# EAGLE schematic PART1 (EAGLE 9.6.2)
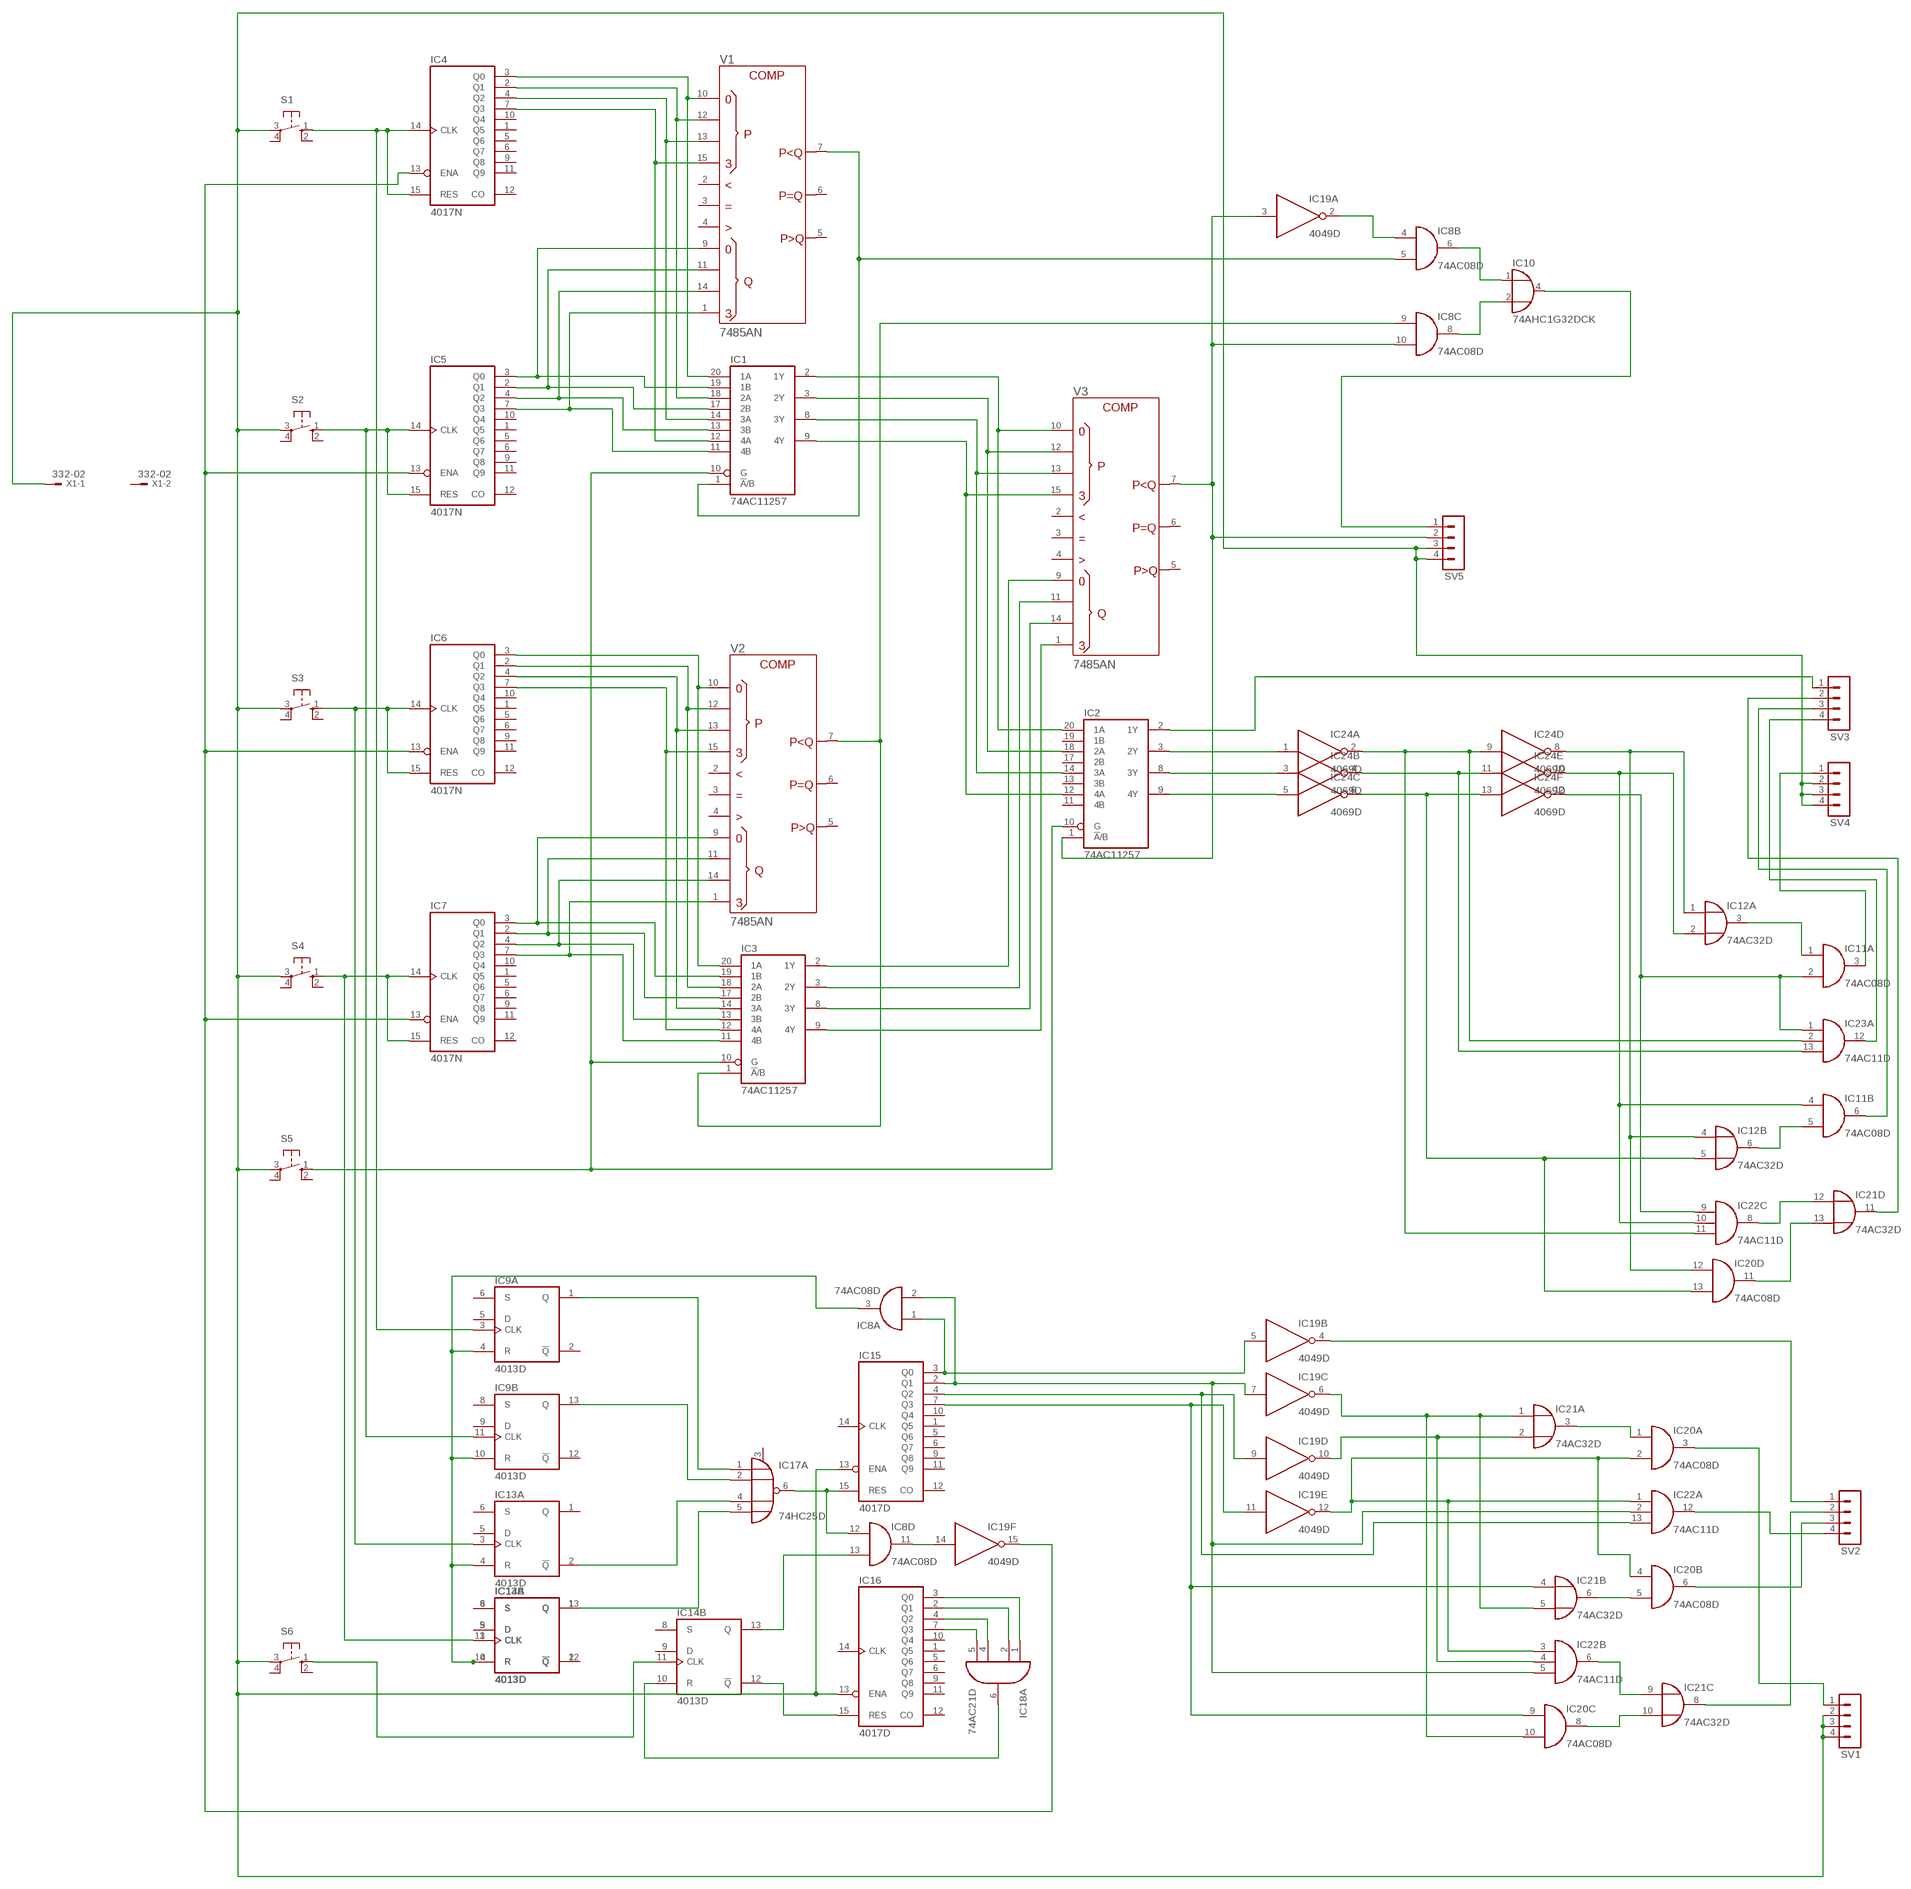
[diagram p0: schematic, sheet 1]

## Parts
IC1  74AC11257  [DIL20]
IC2  74AC11257  [DIL20]
IC3  74AC11257  [DIL20]
IC4  4017N  [DIL16]
IC5  4017N  [DIL16]
IC6  4017N  [DIL16]
IC7  4017N  [DIL16]
IC8  74AC08D  [SO14]
IC9  4013D  [SO14]
IC10  74AHC1G32DCK  [SC70-5]
IC11  74AC08D  [SO14]
IC12  74AC32D  [SO14]
IC13  4013D  [SO14]
IC14  4013D  [SO14]
IC15  4017D  [SO16]
IC16  4017D  [SO16]
IC17  74HC25D  [SO14]
IC18  74AC21D  [SO14]
IC19  4049D  [SO16]
IC20  74AC08D  [SO14]
IC21  74AC32D  [SO14]
IC22  74AC11D  [SO14]
IC23  74AC11D  [SO14]
IC24  4069D  [SO14]
S1  10-XX  [B3F-10XX]
S2  10-XX  [B3F-10XX]
S3  10-XX  [B3F-10XX]
S4  10-XX  [B3F-10XX]
S5  10-XX  [B3F-10XX]
S6  10-XX  [B3F-10XX]
SV1  MA04-1  [MA04-1]
SV2  MA04-1  [MA04-1]
SV3  MA04-1  [MA04-1]
SV4  MA04-1  [MA04-1]
SV5  MA04-1  [MA04-1]
V1  7485AN  [DIL16]
V2  7485AN  [DIL16]
V3  7485AN  [DIL16]
X1  332-02  [332-02]

## Nets
N$1: IC13.2(A:!Q) IC17.4(A:I2)
N$2: IC1.20(1A) IC4.3(Q0) V1.10(P0)
N$3: IC5.14(CLK) IC5.15(RES) IC9.11(B:CLK) S2.1(S)
N$4: IC6.14(CLK) IC6.15(RES) IC13.3(A:CLK) S3.1(S)
N$5: IC1.18(2A) IC4.2(Q1) V1.12(P1)
N$6: IC1.14(3A) IC4.4(Q2) V1.13(P2)
N$7: IC4.13(ENA) IC5.13(ENA) IC6.13(ENA) IC7.13(ENA) IC19.15(F:O)
N$8: IC1.12(4A) IC4.7(Q3) V1.15(P3)
N$9: IC1.19(1B) IC5.3(Q0) V1.9(Q0)
N$10: IC1.17(2B) IC5.2(Q1) V1.11(Q1)
N$11: IC1.13(3B) IC5.4(Q2) V1.14(Q2)
N$12: IC1.11(4B) IC5.7(Q3) V1.1(Q3)
N$13: IC3.11(4B) IC7.7(Q3) V2.1(Q3)
N$14: IC1.10(G) IC2.10(G) IC3.10(G) S5.1(S)
N$15: IC1.2(1Y) IC2.20(1A) V3.10(P0)
N$16: IC1.3(2Y) IC2.18(2A) V3.12(P1)
N$17: IC3.20(1A) IC6.3(Q0) V2.10(P0)
N$18: IC3.18(2A) IC6.2(Q1) V2.12(P1)
N$19: IC3.14(3A) IC6.4(Q2) V2.13(P2)
N$20: IC3.12(4A) IC6.7(Q3) V2.15(P3)
N$21: IC3.19(1B) IC7.3(Q0) V2.9(Q0)
N$22: IC3.17(2B) IC7.2(Q1) V2.11(Q1)
N$23: IC3.13(3B) IC7.4(Q2) V2.14(Q2)
N$24: IC1.8(3Y) IC2.14(3A) V3.13(P2)
N$25: IC2.1(!A!/B) IC8.10(C:I1) IC19.3(A:I) SV5.2 V3.7(PLTQ)
N$26: IC3.9(4Y) V3.1(Q3)
N$27: IC3.8(3Y) V3.14(Q2)
N$28: IC3.3(2Y) V3.11(Q1)
N$29: IC1.1(!A!/B) IC8.5(B:I1) V1.7(PLTQ)
N$30: IC3.1(!A!/B) IC8.9(C:I0) V2.7(PLTQ)
N$31: IC3.2(1Y) V3.9(Q0)
N$32: IC8.4(B:I0) IC19.2(A:O)
N$33: IC8.8(C:O) IC10.2(I1)
N$34: IC8.6(B:O) IC10.1(I0)
N$35: IC10.4(O) SV5.1
N$36: IC1.9(4Y) IC2.12(4A) V3.15(P3)
N$38: IC22.11(C:I2) IC23.2(A:I1) IC24.2(A:O) IC24.9(D:I)
N$39: IC23.13(A:I2) IC24.4(B:O) IC24.11(E:I)
N$40: IC12.5(B:I1) IC20.13(D:I1) IC24.6(C:O) IC24.13(F:I)
N$41: IC12.1(A:I0) IC12.4(B:I0) IC20.12(D:I0) IC24.8(D:O)
N$42: IC2.9(4Y) IC24.5(C:I)
N$43: IC2.8(3Y) IC24.3(B:I)
N$44: IC2.3(2Y) IC24.1(A:I)
N$45: IC2.2(1Y) SV3.1
N$47: IC11.2(A:I1) IC22.9(C:I0) IC23.1(A:I0) IC24.12(F:O)
N$48: IC11.1(A:I0) IC12.3(A:O)
N$49: IC11.3(A:O) SV4.1
N$51: IC13.13(B:Q) IC14.1(A:Q)
N$52: IC13.12(B:!Q) IC14.2(A:!Q)
N$53: IC7.14(CLK) IC7.15(RES) IC13.11(B:CLK) IC14.3(A:CLK) S4.1(S)
N$54: IC8.3(A:O) IC9.4(A:R) IC9.10(B:R) IC13.4(A:R) IC13.10(B:R) IC14.4(A:R)
N$55: IC13.9(B:D) IC14.5(A:D)
N$56: IC13.8(B:S) IC14.6(A:S)
N$57: IC8.1(A:I0) IC15.3(Q0) IC19.5(B:I)
N$58: IC8.2(A:I1) IC15.2(Q1) IC19.7(C:I) IC22.2(A:I1) IC22.5(B:I2)
N$59: IC15.13(ENA) IC16.13(ENA) S1.3(P) S2.3(P) S3.3(P) S4.3(P) S5.3(P) S6.3(P) SV1.2 SV1.3 SV1.4 SV4.2 SV4.3 SV4.4 SV5.3 SV5.4 X1.1
N$60: IC9.1(A:Q) IC17.1(A:I0)
N$61: IC9.13(B:Q) IC17.2(A:I1)
N$62: IC17.5(A:I3)
N$63: IC8.12(D:I0) IC15.15(RES) IC17.6(A:O)
N$64: IC16.3(Q0) IC18.1(A:I0)
N$65: IC16.2(Q1) IC18.2(A:I1)
N$66: IC16.4(Q2) IC18.4(A:I2)
N$67: IC16.7(Q3) IC18.5(A:I3)
N$68: IC14.10(B:R) IC18.6(A:O)
N$69: IC8.13(D:I1) IC14.13(B:Q)
N$70: IC14.11(B:CLK) S6.1(S)
N$71: IC14.12(B:!Q) IC16.15(RES)
N$72: IC15.4(Q2) IC19.9(D:I) IC22.13(A:I2)
N$73: IC15.7(Q3) IC19.11(E:I) IC20.9(C:I0) IC21.4(B:I0)
N$74: IC8.11(D:O) IC19.14(F:I)
N$75: IC19.6(C:O) IC20.10(C:I1) IC21.1(A:I0) IC21.5(B:I1)
N$76: IC4.14(CLK) IC4.15(RES) IC9.3(A:CLK) S1.1(S)
N$77: IC19.10(D:O) IC21.2(A:I1) IC22.4(B:I1)
N$78: IC20.1(A:I0) IC21.3(A:O)
N$79: IC19.12(E:O) IC20.2(A:I1) IC20.4(B:I0) IC22.1(A:I0) IC22.3(B:I0)
N$80: IC19.4(B:O) SV2.1
N$81: IC21.8(C:O) SV2.2
N$82: IC20.6(B:O) SV2.3
N$83: IC22.12(A:O) SV2.4
N$84: IC20.5(B:I1) IC21.6(B:O)
N$85: IC21.9(C:I0) IC22.6(B:O)
N$86: IC20.8(C:O) IC21.10(C:I1)
N$87: IC20.3(A:O) SV1.1
N$88: IC23.12(A:O) SV3.4
N$89: IC11.5(B:I1) IC12.6(B:O)
N$90: IC11.6(B:O) SV3.3
N$91: IC21.12(D:I0) IC22.8(C:O)
N$92: IC20.11(D:O) IC21.13(D:I1)
N$93: IC11.4(B:I0) IC12.2(A:I1) IC22.10(C:I1) IC24.10(E:O)
N$94: IC21.11(D:O) SV3.2
Unconnected: IC2.11(4B) IC2.13(3B) IC2.17(2B) IC2.19(1B) IC4.1(Q5) IC4.5(Q6) IC4.6(Q7) IC4.9(Q8) IC4.10(Q4) IC4.11(Q9) IC4.12(CO) IC5.1(Q5) IC5.5(Q6) IC5.6(Q7) IC5.9(Q8) IC5.10(Q4) IC5.11(Q9) IC5.12(CO) IC6.1(Q5) IC6.5(Q6) IC6.6(Q7) IC6.9(Q8) IC6.10(Q4) IC6.11(Q9) IC6.12(CO) IC7.1(Q5) IC7.5(Q6) IC7.6(Q7) IC7.9(Q8) IC7.10(Q4) IC7.11(Q9) IC7.12(CO) IC9.2(A:!Q) IC9.5(A:D) IC9.6(A:S) IC9.8(B:S) IC9.9(B:D) IC9.12(B:!Q) IC11.8(C:O) IC11.9(C:I0) IC11.10(C:I1) IC11.11(D:O) IC11.12(D:I0) IC11.13(D:I1) IC12.8(C:O) IC12.9(C:I0) IC12.10(C:I1) IC12.11(D:O) IC12.12(D:I0) IC12.13(D:I1) IC13.1(A:Q) IC13.5(A:D) IC13.6(A:S) IC14.8(B:S) IC14.9(B:D) IC15.1(Q5) IC15.5(Q6) IC15.6(Q7) IC15.9(Q8) IC15.10(Q4) IC15.11(Q9) IC15.12(CO) IC15.14(CLK) IC16.1(Q5) IC16.5(Q6) IC16.6(Q7) IC16.9(Q8) IC16.10(Q4) IC16.11(Q9) IC16.12(CO) IC16.14(CLK) IC17.3(A:G) IC17.8(B:O) IC17.9(B:I0) IC17.10(B:I1) IC17.11(B:G) IC17.12(B:I2) IC17.13(B:I3) IC18.8(B:O) IC18.9(B:I0) IC18.10(B:I1) IC18.12(B:I2) IC18.13(B:I3) IC23.3(B:I0) IC23.4(B:I1) IC23.5(B:I2) IC23.6(B:O) IC23.8(C:O) IC23.9(C:I0) IC23.10(C:I1) IC23.11(C:I2) S1.2(S1) S1.4(P1) S2.2(S1) S2.4(P1) S3.2(S1) S3.4(P1) S4.2(S1) S4.4(P1) S5.2(S1) S5.4(P1) S6.2(S1) S6.4(P1) V1.2(PLTQ_) V1.3(PEQQ_) V1.4(PGTQ_) V1.5(PGTQ) V1.6(PEQQ) V2.2(PLTQ_) V2.3(PEQQ_) V2.4(PGTQ_) V2.5(PGTQ) V2.6(PEQQ) V3.2(PLTQ_) V3.3(PEQQ_) V3.4(PGTQ_) V3.5(PGTQ) V3.6(PEQQ) X1.2

## Power pins joined to a net without a drawn wire
+UB: V1.16(+UB) V2.16(+UB) V3.16(+UB)
-UB: V1.8(-UB) V2.8(-UB) V3.8(-UB)
GND: IC1.4(GND) IC1.5(GND) IC1.6(GND) IC1.7(GND) IC2.4(GND) IC2.5(GND) IC2.6(GND) IC2.7(GND) IC3.4(GND) IC3.5(GND) IC3.6(GND) IC3.7(GND) IC8.7(P:GND) IC10.3(GND) IC11.7(P:GND) IC12.7(P:GND) IC17.7(P:GND) IC18.7(P:GND) IC20.7(P:GND) IC21.7(P:GND) IC22.7(P:GND) IC23.7(P:GND)
VCC: IC1.15(VCC) IC1.16(VCC) IC2.15(VCC) IC2.16(VCC) IC3.15(VCC) IC3.16(VCC) IC8.14(P:VCC) IC10.5(VCC) IC11.14(P:VCC) IC12.14(P:VCC) IC17.14(P:VCC) IC18.14(P:VCC) IC20.14(P:VCC) IC21.14(P:VCC) IC22.14(P:VCC) IC23.14(P:VCC)
VDD: IC4.16(VDD) IC5.16(VDD) IC6.16(VDD) IC7.16(VDD) IC9.14(P:VDD) IC13.14(P:VDD) IC14.14(P:VDD) IC15.16(VDD) IC16.16(VDD) IC19.1(P:VDD) IC24.14(P:VDD)
VSS: IC4.8(VSS) IC5.8(VSS) IC6.8(VSS) IC7.8(VSS) IC9.7(P:VSS) IC13.7(P:VSS) IC14.7(P:VSS) IC15.8(VSS) IC16.8(VSS) IC19.8(P:VSS) IC24.7(P:VSS)

## Library data of the parts
IC1-IC3 = 74ac-logic:74AC11257: Quadruple 2 to 1 line DATA SELECTOR/MULTIPLEXER, 3-state
IC4-IC7 IC15 IC16 = 40xx:4017: COUNTER/DIVIDER
IC8 IC11 IC20 = 74xx-eu:74*08: Quad 2-input AND gate
IC9 IC13 IC14 = 40xx:4013: Dual D FLIP FLOP, set/reset
IC10 = 74xx-little-de:74*1G32: 2-input OR gate
IC12 IC21 = 74xx-eu:74*32: Quad 2-input OR gate
IC17 = 74xx-eu:74*25: Dual 4-input NOR gate, strobe
IC18 = 74xx-eu:74*21: Dual 4-input AND gate
IC19 = 40xx:4049: Hex inverting BUFFER
IC22 IC23 = 74xx-eu:74*11: Triple 3-input AND gate
IC24 = 40xx:4069: Hex INVERTER
S1-S6 = switch-omron:10-XX: OMRON SWITCH; MPN: B3F-1000; OC_FARNELL: 176432; OC_NEWARK: 36M3542
SV1-SV5 = con-lstb:MA04-1: PIN HEADER; OC_FARNELL: unknown; OC_NEWARK: unknown
V1-V3 = 74ttl-din:74*85A: 4-bit Magnitude COMPARATOR
X1 = con-garry:332-02: 2 Pin - 2mm Dual Row Source: www.mpe-connector.de / garry_shortform_2012.pdf